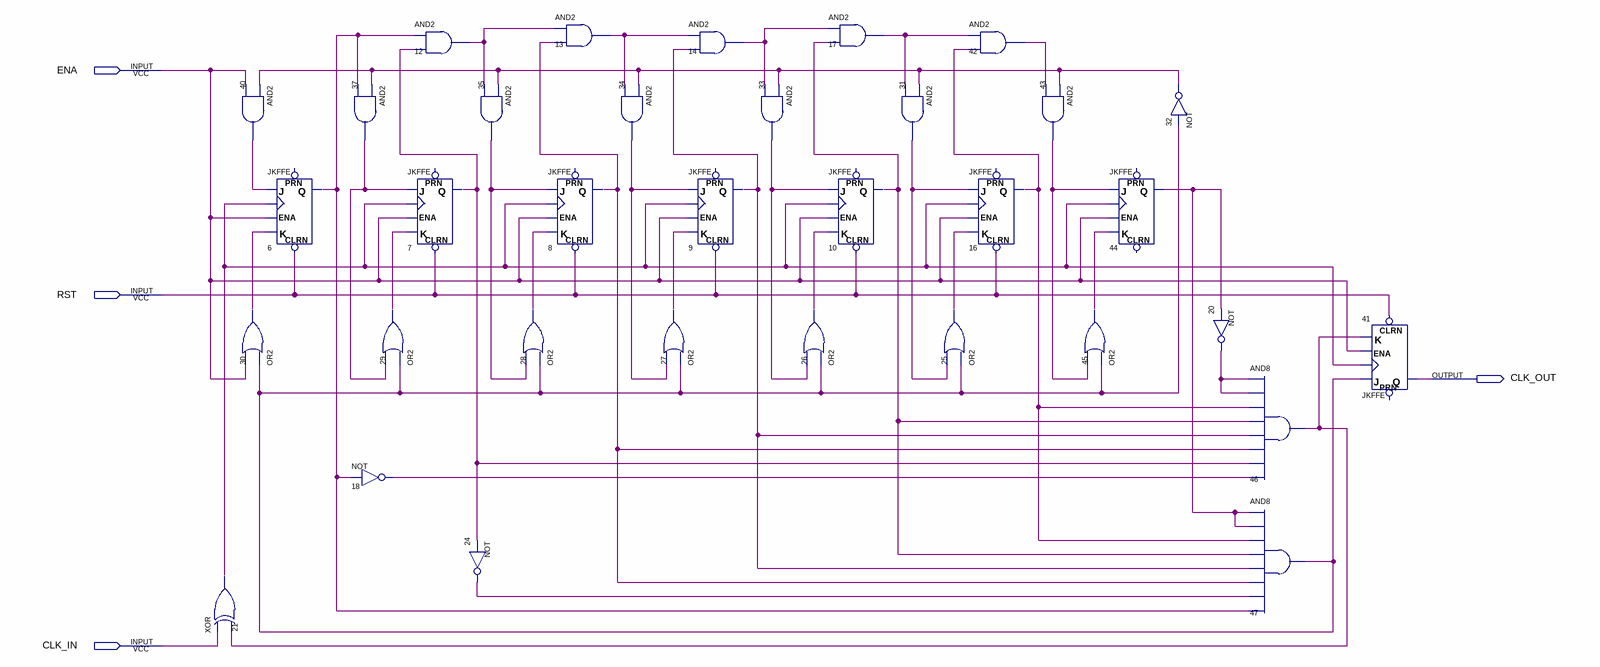
[diagram p0: schematic sheet]
// Quartus schematic div125.bdf as structural Verilog: 34 symbols, 4 pins
module div125 (
  input  ENA,
  input  RST,
  input  CLK_IN,
  output CLK_OUT
);

  wire n6_q, n7_q, n8_q, n9_q, n10_q, n12_out, n13_out, n14_out, n16_q, n17_out, n18_out, n20_out, n21_out,
       n24_out, n25_out, n26_out, n27_out, n28_out, n29_out, n30_out, n31_out, n32_out, n33_out, n34_out,
       n35_out, n37_out, n40_out, n42_out, n43_out, n44_q, n45_out, n46_out, n47_out;

  xor u_21 (n21_out, CLK_IN, n46_out);
  and u_40 (n40_out, n32_out, ENA);
  JKFFE u_6 (.J(n40_out), .CLK(n21_out), .CLRN(RST), .K(n30_out), .ENA(ENA), .Q(n6_q));  // open: PRN
  or u_30 (n30_out, n47_out, ENA);
  and u_37 (n37_out, n32_out, n6_q);
  or u_29 (n29_out, n47_out, n37_out);
  not u_18 (n18_out, n6_q);
  and u_12 (n12_out, n6_q, n7_q);
  JKFFE u_7 (.J(n37_out), .CLK(n21_out), .CLRN(RST), .K(n29_out), .ENA(ENA), .Q(n7_q));  // open: PRN
  and u_35 (n35_out, n32_out, n12_out);
  not u_24 (n24_out, n7_q);
  and u_13 (n13_out, n12_out, n8_q);
  JKFFE u_8 (.J(n35_out), .CLK(n21_out), .CLRN(RST), .K(n28_out), .ENA(ENA), .Q(n8_q));  // open: PRN
  or u_28 (n28_out, n47_out, n35_out);
  and u_34 (n34_out, n32_out, n13_out);
  or u_27 (n27_out, n47_out, n34_out);
  and u_14 (n14_out, n13_out, n9_q);
  JKFFE u_9 (.J(n34_out), .CLK(n21_out), .CLRN(RST), .K(n27_out), .ENA(ENA), .Q(n9_q));  // open: PRN
  and u_33 (n33_out, n32_out, n14_out);
  and u_17 (n17_out, n14_out, n10_q);
  JKFFE u_10 (.J(n33_out), .CLK(n21_out), .CLRN(RST), .K(n26_out), .ENA(ENA), .Q(n10_q));  // open: PRN
  or u_26 (n26_out, n47_out, n33_out);
  and u_31 (n31_out, n32_out, n17_out);
  or u_25 (n25_out, n47_out, n31_out);
  and u_42 (n42_out, n17_out, n16_q);
  JKFFE u_16 (.J(n31_out), .CLK(n21_out), .CLRN(RST), .K(n25_out), .ENA(ENA), .Q(n16_q));  // open: PRN
  and u_43 (n43_out, n32_out, n42_out);
  JKFFE u_44 (.J(n43_out), .CLK(n21_out), .K(n45_out), .ENA(ENA), .Q(n44_q));  // open: PRN, CLRN
  or u_45 (n45_out, n47_out, n43_out);
  not u_32 (n32_out, n47_out);
  not u_20 (n20_out, n44_q);
  and u_46 (n46_out, n20_out, n20_out, n16_q, n10_q, n9_q, n8_q, n7_q, n18_out);
  and u_47 (n47_out, n44_q, n44_q, n16_q, n10_q, n9_q, n8_q, n24_out, n6_q);
  JKFFE u_41 (.J(n47_out), .CLK(n21_out), .CLRN(RST), .K(n46_out), .ENA(ENA), .Q(CLK_OUT));  // open: PRN
endmodule
